# EAGLE design PAC_Attack_RevB (EAGLE 9.6.2)
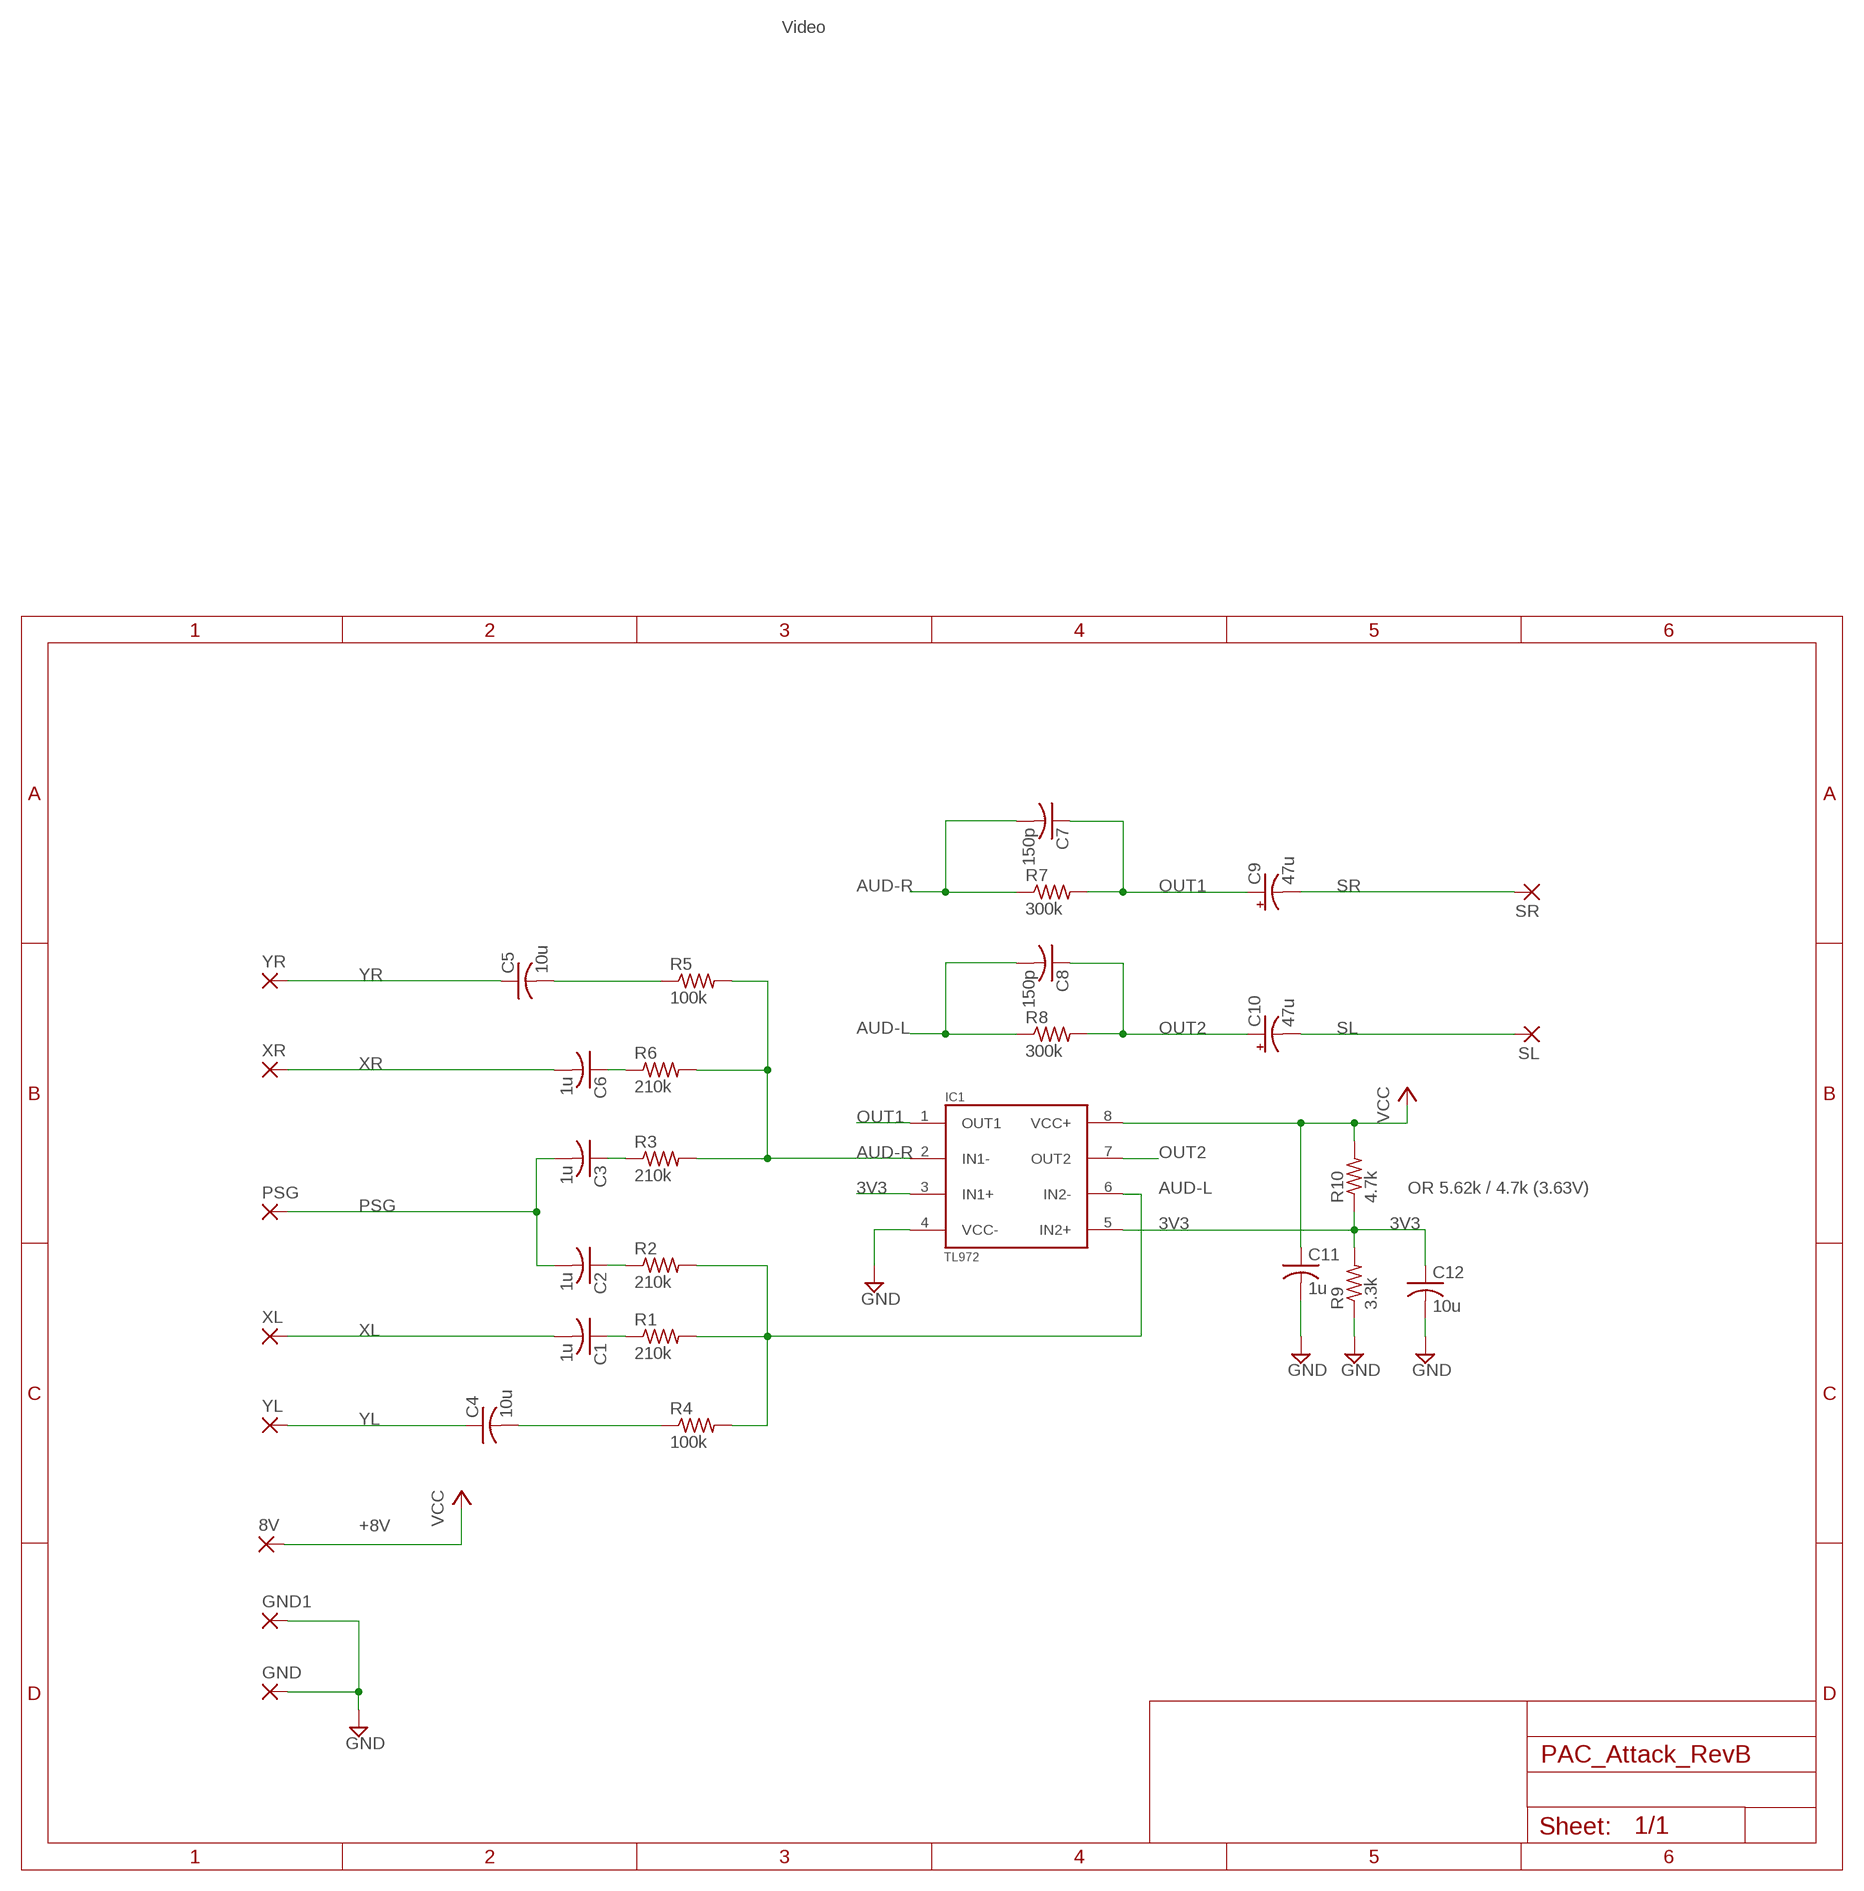
[diagram p0: schematic, sheet 1]

## Parts
8V  SMD2  [SMD1,27-2,54]
C1  1u  C-USC0603  [C0603]
C2  1u  C-USC0603  [C0603]
C3  1u  C-USC0603  [C0603]
C4  10u  C-USC0805  [C0805]
C5  10u  C-USC0805  [C0805]
C6  1u  C-USC0603  [C0603]
C7  150p  C-USC0603  [C0603]
C8  150p  C-USC0603  [C0603]
C9  47u  CPOL-USCT3528  [CT3528]
C10  47u  CPOL-USCT3528  [CT3528]
C11  1u  C-USC0603  [C0603]
C12  10u  C-USC1206  [C1206]
GND  SMD2  [SMD1,27-2,54]
GND1  SMD2  [SMD1,27-2,54]
IC1  TL972  [SOIC8]
PSG  SMD2  [SMD1,27-2,54]
R1  210k  R-US_R0603  [R0603]
R2  210k  R-US_R0603  [R0603]
R3  210k  R-US_R0603  [R0603]
R4  100k  R-US_R0603  [R0603]
R5  100k  R-US_R0603  [R0603]
R6  210k  R-US_R0603  [R0603]
R7  300k  R-US_R0603  [R0603]
R8  300k  R-US_R0603  [R0603]
R9  3.3k  R-US_R0603  [R0603]
R10  4.7k  R-US_R0603  [R0603]
SL  SMD2  [SMD1,27-2,54]
SR  SMD2  [SMD1,27-2,54]
XL  SMD2  [SMD1,27-2,54]
XR  SMD2  [SMD1,27-2,54]
YL  SMD2  [SMD1,27-2,54]
YR  SMD2  [SMD1,27-2,54]

## Nets
3V3: C12.1 IC1.3(IN1+) IC1.5(IN2+) R9.2 R10.1
+8V: 8V.1(P) C11.1 IC1.8(VCC+) R10.2 ; supply symbol labelled VCC
AUD-L: C8.2 IC1.6(IN2-) R1.2 R2.2 R4.2 R8.1
AUD-R: C7.2 IC1.2(IN1-) R3.2 R5.2 R6.2 R7.1
GND: C11.2 C12.2 GND1.1(P) GND.1(P) IC1.4(VCC-) R9.1
N$1: C5.2 R5.1
N$2: C4.2 R4.1
N$23: C6.1 R6.1
N$27: C3.1 R3.1
N$28: C2.1 R2.1
N$30: C1.1 R1.1
OUT1: C7.1 C9.+ IC1.1(OUT1) R7.2
OUT2: C8.1 C10.+ IC1.7(OUT2) R8.2
PSG: C2.2 C3.2 PSG.1(P)
SL: C10.- SL.1(P)
SR: C9.- SR.1(P)
XL: C1.2 XL.1(P)
XR: C6.2 XR.1(P)
YL: C4.1 YL.1(P)
YR: C5.1 YR.1(P)

## Notes on the sheet
- Video
- OR 5.62k / 4.7k (3.63V)

## Library data of the parts
8V GND GND1 PSG SL SR XL XR YL YR = wirepad:SMD2: SMD PAD
C1-C8 C11 C12 = My_Devices:C-US: CAPACITOR, American symbol
C9 C10 = My_Devices:CPOL-US: POLARIZED CAPACITOR, American symbol; SPICEPREFIX: C
IC1 = My_Devices:TL972
R1-R10 = My_Devices:R-US_: RESISTOR, American symbol

## Board
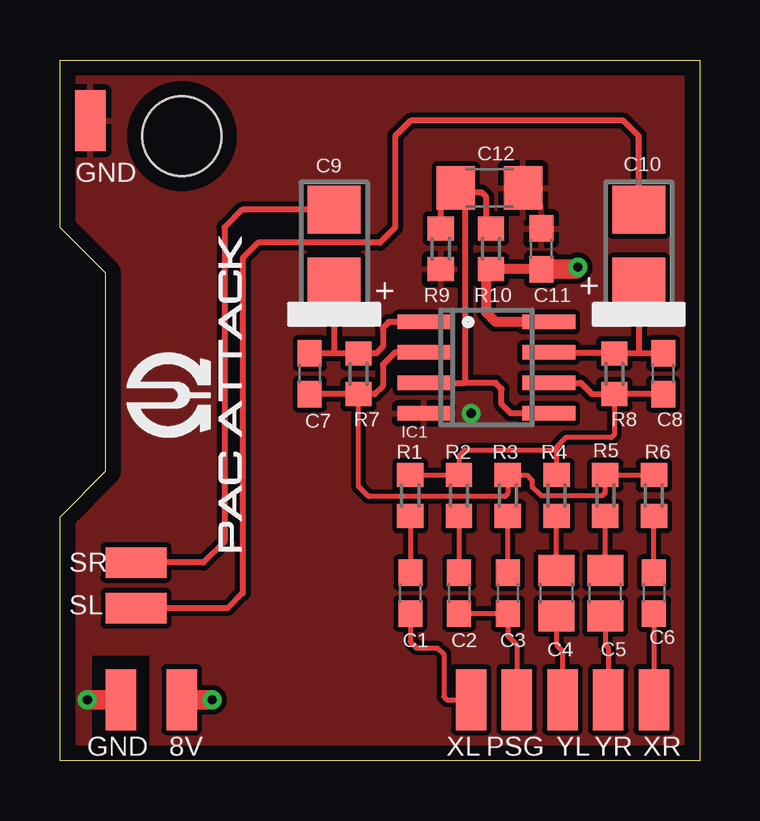
[diagram p1: board, top side]
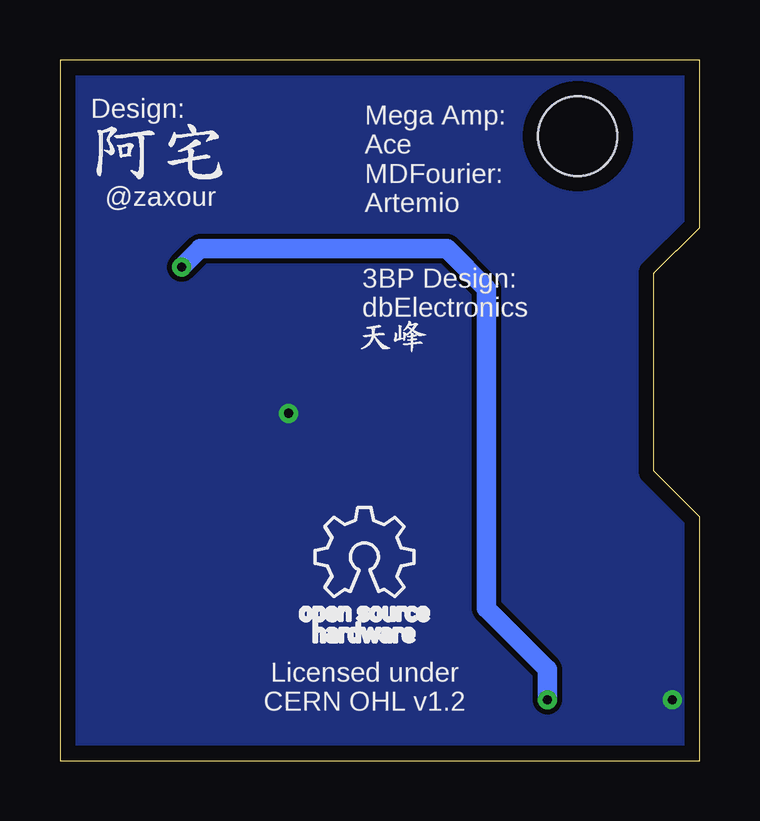
[diagram p2: board, bottom side, seen from below]

Size 26.67 x 29.21 mm. Coordinates in mm from the lower left corner, seen from the top.
Outline: 0,0 0,10.16 1.91,12.06 1.91,20.32 0,22.23 0,29.21 26.67,29.21 26.67,0 0,0
Copper layers (1*16): Top 0.035mm / dielectric 1.5mm / Bottom 0.035mm
Design rules "default *": minimum track width 5mil, minimum drill 15mil, track to track 8mil, track to pad 8mil, pad to pad 8mil, via to via 8mil, smd to smd 8mil, copper to edge 25mil, drill to drill 8mil, minimum pad ring 10mil, minimum via ring 8mil, stop-mask expansion 4mil, vias tented up to drill 18mil, thermal gap 10mil
Holes 3.3 mm at 5.08,26.04

### Footprints (pad centres in the part's own frame; a part is rotated, then mirrored left to right if it is on the bottom)
SMD1,27-2,54 = smd 1.27 x 2.54: 1 0,0
C0603 = smd 1.1 x 1: 1 -0.85,0; 2 0.85,0
C0805 = smd 1.3 x 1.5: 1 -0.95,0; 2 0.95,0
CT3528 = smd 2 x 2.2: + -1.5,0; - 1.5,0
C1206 = smd 1.6 x 1.8: 1 -1.4,0; 2 1.4,0
SOIC8 = smd 0.6 x 2.2: 1 -1.905,-2.6; 2 -0.635,-2.6; 3 0.635,-2.6; 4 1.905,-2.6; 5 1.905,2.6; 6 0.635,2.6; 7 -0.635,2.6; 8 -1.905,2.6
R0603 = smd 1 x 1.1: 1 -0.85,0; 2 0.85,0

### Placement (x,y rotation side)
8V  5.08,2.54 0 top
C1  14.61,6.99 270 top
C2  16.64,6.99 270 top
C3  18.67,6.99 270 top
C4  20.7,6.99 90 top
C5  22.73,6.99 90 top
C6  24.77,6.99 270 top
C7  10.41,16.13 270 top
C8  25.15,16.13 270 top
C9  11.43,21.46 90 top
C10  24.13,21.46 90 top
C11  20.07,21.34 90 top
C12  17.91,23.88 0 top
GND  2.54,2.54 180 top
GND1  1.27,26.67 0 top
IC1  17.78,16.38 270 top
PSG  19.05,2.54 0 top
R1  14.61,11.05 90 top
R2  16.64,11.05 90 top
R3  18.67,11.05 90 top
R4  20.7,11.05 90 top
R5  22.73,11.05 90 top
R6  24.77,11.05 90 top
R7  12.45,16.13 90 top
R8  23.11,16.13 90 top
R9  15.88,21.34 90 top
R10  17.97,21.34 270 top
SL  3.17,6.35 270 top
SR  3.17,8.26 90 top
XL  17.14,2.54 0 top
XR  24.77,2.54 0 top
YL  20.95,2.54 0 top
YR  22.86,2.54 0 top

### Tracks (layer width: path | path; a pad name or v marks a point on that pad's centre or on a via)
3V3
  Top 0.254: R9.2 15.88,23.24 16.32,23.69 | 16.32,23.69 C12.1 16.89,23.49 16.89,15.75 | IC1.3 16.89,15.75 | IC1.5 18.8,14.48 18.41,14.86 18.41,15.49 18.16,15.75 16.89,15.75 | R10.1 17.78,22.38 17.78,23.5 17.59,23.69 16.32,23.69
+8V  (via drill 0.38)
  Top 0.406: C11.1 R10.2 17.78,20.3 17.78,18.67 18.16,18.29 IC1.8
  Top 0.508: 19.9,20.49 C11.1
  Top 0.813: 8V.1 v6.35,2.54 | C11.1 21.5,20.49 v21.59,20.57
  Bottom 0.813: v6.35,2.54 6.35,3.81 8.89,6.35 8.89,19.68 10.54,21.34 20.83,21.34 v21.59,20.57
AUD-L
  Top 0.203: R1.2 R2.2 16.64,12.7 16.89,12.95 20.7,12.95 | R8.1 23.11,13.59 22.99,13.46 21.08,13.46 20.7,13.08 20.7,12.95 | 20.7,12.95 R4.2
  Top 0.254: C8.2 R8.1 22.19,15.28 21.72,15.75 IC1.6
AUD-R
  Top 0.203: R6.2 R5.2 22.73,11.18 22.61,11.05 20.07,11.05 19.68,11.43 19.68,11.68 19.47,11.9 R3.2 18.67,11.13 18.54,11 12.87,11 12.45,11.43 12.45,15.03 12.7,15.28
  Top 0.254: C7.2 R7.1 12.7,15.28 13.12,15.28 13.46,15.62 13.46,16.51 13.97,17.02 IC1.2
GND  (via drill 0.38)
  Top 0.813: GND.1 v1.14,2.54
  other vias: 17.14,14.48
  pour Top: -0.64,29.84 27.3,29.84 27.3,-1.27 3.81,-1.27 3.81,4.45 1.27,4.45 1.27,-1.27 -0.64,-1.27
  pour Bottom (rank 2): -1.91,31.11 28.57,31.11 28.57,-1.91 -1.91,-1.91
N$1
  Top 0.203: C5.2 R5.1
N$2
  Top 0.203: C4.2 R4.1
N$23
  Top 0.203: C6.1 R6.1
N$27
  Top 0.203: C3.1 R3.1
N$28
  Top 0.203: R2.1 C2.1
N$30
  Top 0.203: R1.1 C1.1
OUT1
  Top 0.254: IC1.1 13.72,18.29 13.46,18.03 13.46,17.27 13.17,16.98 R7.2 11.43,16.98 | 11.43,16.98 C7.1 | C9.+ 11.43,16.98
OUT2
  Top 0.254: C8.1 24.13,16.98 | 24.13,16.98 R8.2 23.07,17.02 IC1.7 | C10.+ 24.13,16.98
PSG
  Top 0.203: C2.2 C3.2 18.67,5.21 19.05,4.83 PSG.1
SL
  Top 0.254: C10.- 24.13,26.04 23.5,26.67 14.61,26.67 13.97,26.04 13.97,22.23 13.34,21.59 8.26,21.59 7.62,20.95 7.62,6.99 6.99,6.35 SL.1
SR
  Top 0.254: C9.- 7.6,22.96 6.86,22.23 6.86,9.14 5.97,8.26 SR.1
XL
  Top 0.203: C1.2 14.61,4.95 14.86,4.7 15.75,4.7 16,4.45 16,2.67 16.13,2.54 XL.1
XR
  Top 0.203: C6.2 XR.1
YL
  Top 0.203: C4.1 20.7,4.83 20.95,4.57 YL.1
YR
  Top 0.203: C5.1 22.73,4.83 22.86,4.7 YR.1

### Text on the board
tPlace: GND | + | +
bPlace: Design: | @zaxour | Mega Amp: / Ace / MDFourier: / Artemio | 3BP Design: / dbElectronics | Licensed under / CERN OHL v1.2